# EAGLE design gnss (EAGLE 9.6.2)
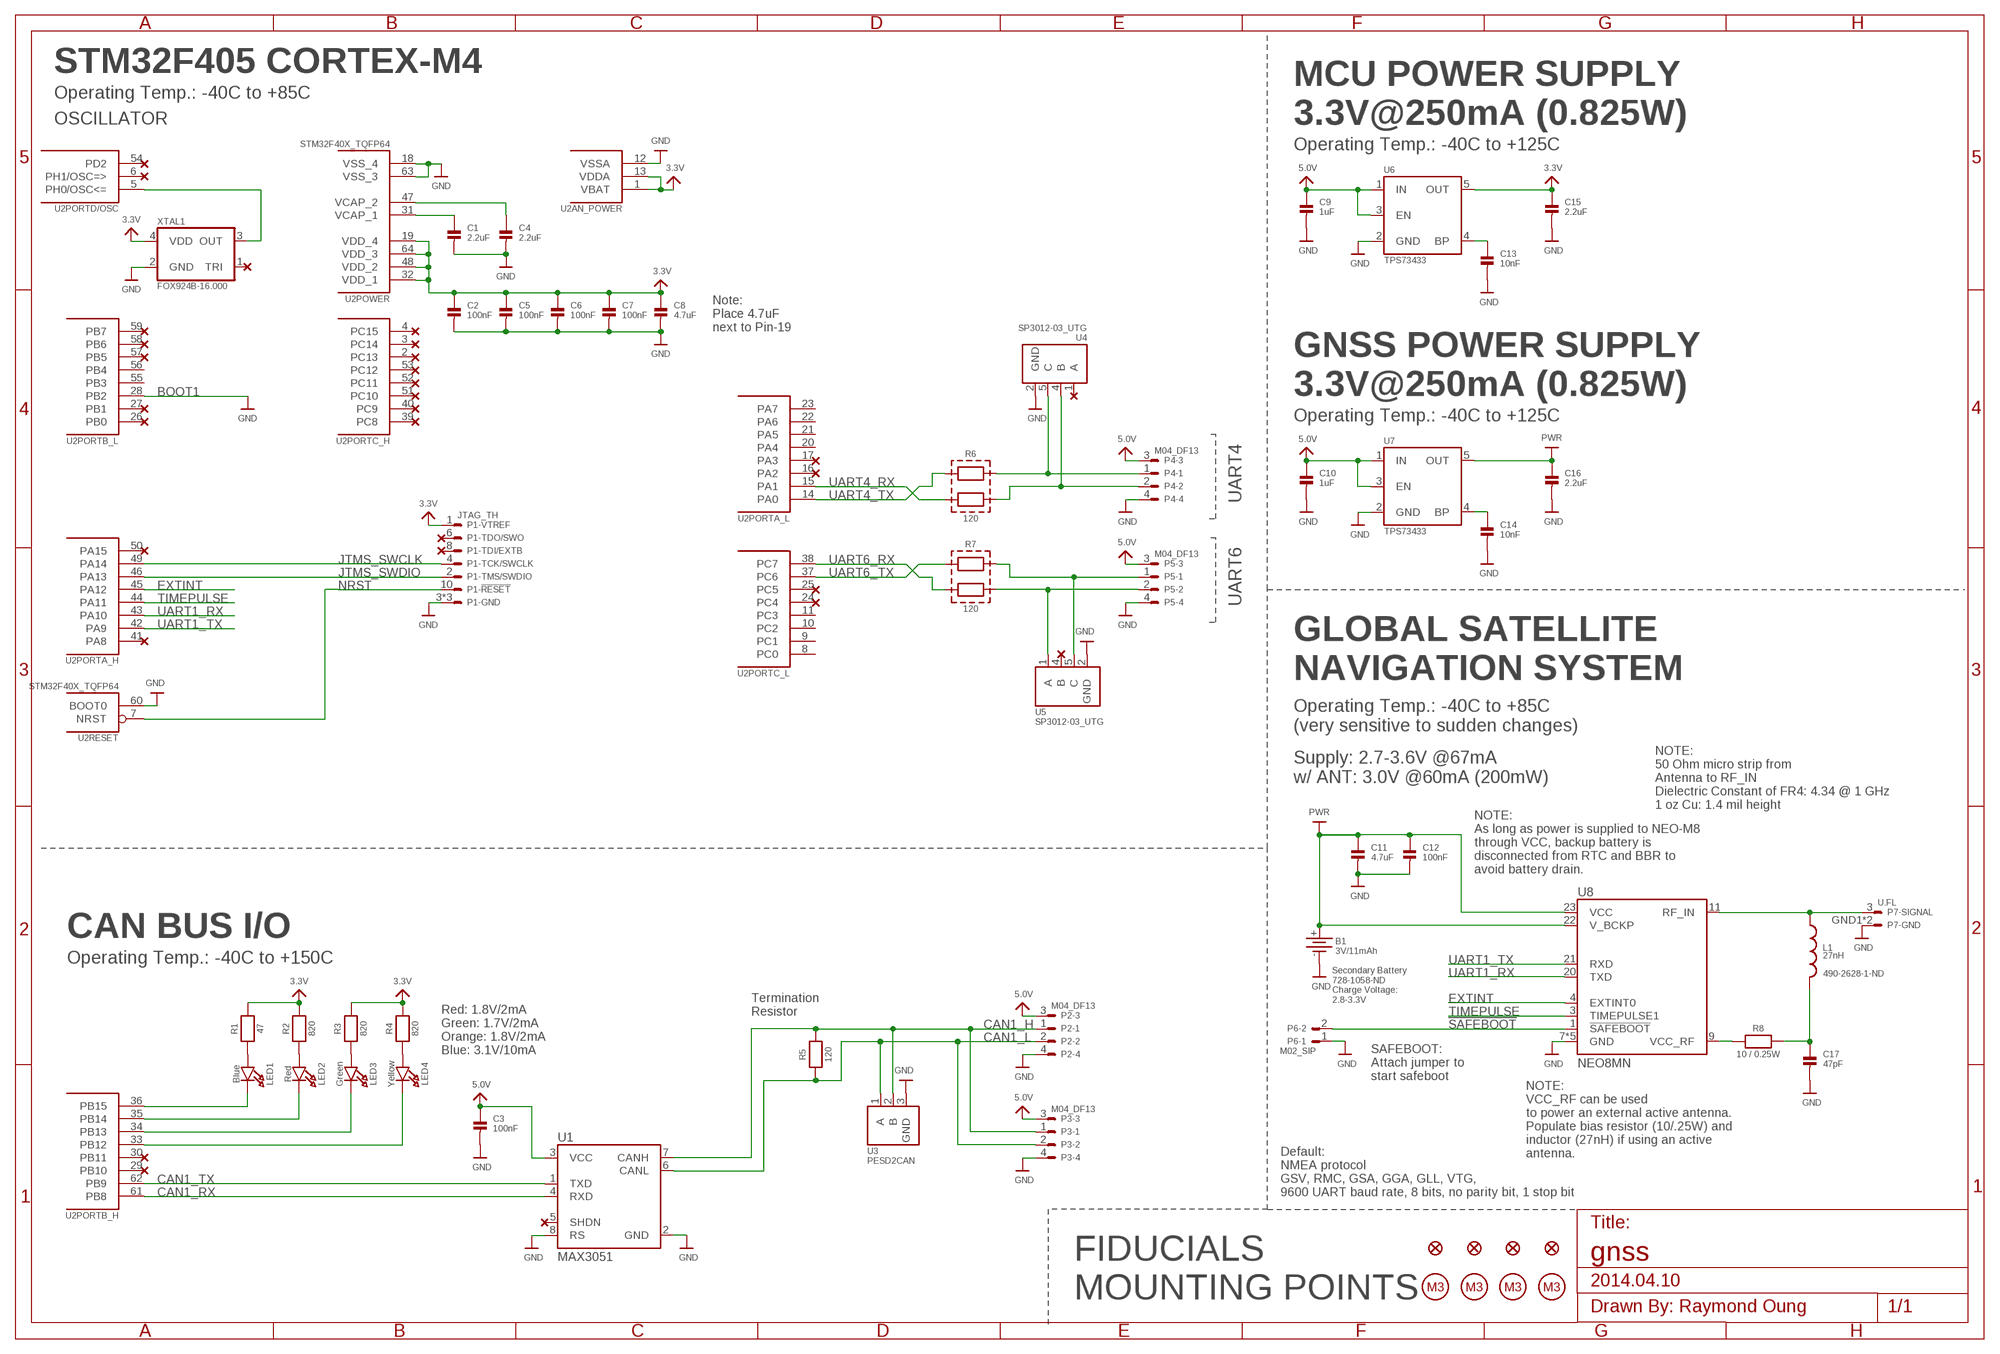
[diagram p0: schematic, sheet 1]

## Parts
B1  3V/11mAh  BATTERY_MS920SE  [MS920SE]
C1  2.2uF  CAP_CERAMIC0402  [0402]
C2  100nF  CAP_CERAMIC0402  [0402]
C3  100nF  CAP_CERAMIC0402  [0402]
C4  2.2uF  CAP_CERAMIC0402  [0402]
C5  100nF  CAP_CERAMIC0402  [0402]
C6  100nF  CAP_CERAMIC0402  [0402]
C7  100nF  CAP_CERAMIC0402  [0402]
C8  4.7uF  CAP_CERAMIC0402  [0402]
C9  1uF  CAP_CERAMIC0402  [0402]
C10  1uF  CAP_CERAMIC0402  [0402]
C11  4.7uF  CAP_CERAMIC0402  [0402]
C12  100nF  CAP_CERAMIC0402  [0402]
C13  10nF  CAP_CERAMIC0402  [0402]
C14  10nF  CAP_CERAMIC0402  [0402]
C15  2.2uF  CAP_CERAMIC0402  [0402]
C16  2.2uF  CAP_CERAMIC0402  [0402]
C17  47pF  CAP_CERAMIC0402  [0402]
L1  27nH  INDUCTOR_0402  [L0402]
LED1  Blue  LED_0603  [CHIPLED_0603]
LED2  Red  LED_0603  [CHIPLED_0603]
LED3  Green  LED_0603  [CHIPLED_0603]
LED4  Yellow  LED_0603  [CHIPLED_0603]
MP1  M3  [MP_M3]
MP2  M3  [MP_M3]
MP3  M3  [MP_M3]
MP4  M3  [MP_M3]
P1  JTAG_TH  [FTSH-105-01-XXX-DV]
P2  M04_DF13  [DF13A-4P-1.25H]
P3  M04_DF13  [DF13A-4P-1.25H]
P4  M04_DF13  [DF13A-4P-1.25H]
P5  M04_DF13  [DF13A-4P-1.25H]
P6  M02_SIP  [1X02_LOCK]
P7  U.FL  [U.FL]
R1  47  RESISTOR0402  [0402]
R2  820  RESISTOR0402  [0402]
R3  820  RESISTOR0402  [0402]
R4  820  RESISTOR0402  [0402]
R5  120  RESISTOR0603  [0603]
R6  120  RESISTOR2_0603X2  [EXBV4V]
R7  120  RESISTOR2_0603X2  [EXBV4V]
R8  10 / 0.25W  RESISTOR0603  [0603]
REF1  FIDUCIAL1X2.5  [POINT-1MM]
REF2  FIDUCIAL1X2.5  [POINT-1MM]
REF3  FIDUCIAL1X2.5  [POINT-1MM]
REF4  FIDUCIAL1X2.5  [POINT-1MM]
U1  MAX3051  [SOT23-8]
U2  STM32F40X_TQFP64  [TQFP64]
U3  PESD2CAN  [SOT23-3]
U4  SP3012-03_UTG  [UDFN06]
U5  SP3012-03_UTG  [UDFN06]
U6  TPS73433  [SOT23-5]
U7  TPS73433  [SOT23-5]
U8  NEO8MN  [NEOX]
XTAL1  FOX924B-16.000  TCXO_5.0X3.2A  [OSCILLATOR-5.0X3.2A]

## Nets
3.3V [PWR]: C2.1 C5.1 C6.1 C7.1 C8.1 C15.1 P1.1 R1.2 R2.2 R3.2 R4.2 U2.1(AN_POWER:VBAT) U2.13(AN_POWER:VDDA) U2.19(POWER:VDD_4) U2.32(POWER:VDD_1) U2.48(POWER:VDD_2) U2.64(POWER:VDD_3) U6.5(OUT) XTAL1.4(VDD)
5.0V [PWR]: C3.1 C9.1 C10.1 P2.3 P3.3 P4.3 P5.3 U1.3(VCC) U6.1(IN) U6.3(EN) U7.1(IN) U7.3(EN)
!SAFEBOOT: P6.2 U8.1(!SAFEBOOT)
CAN1_H: P2.1 P3.1 R5.2 U1.7(CANH) U3.2(B)
CAN1_L: P2.2 P3.2 R5.1 U1.6(CANL) U3.1(A)
CAN1_RX: U1.4(RXD) U2.61(PORTB_H:PB8)
CAN1_TX: U1.1(TXD) U2.62(PORTB_H:PB9)
EXTINT: U2.45(PORTA_H:PA12) U8.4(EXTINT0)
GND [PWR]: B1.- C1.2 C2.2 C3.2 C4.2 C5.2 C6.2 C7.2 C8.2 C9.2 C10.2 C11.2 C12.2 C13.2 C14.2 C15.2 C16.2 C17.2 P1.3 P1.5 P1.9 P2.4 P3.4 P4.4 P5.4 P6.1 P7.GND1 P7.GND2 U1.2(GND) U1.8(RS) U2.12(AN_POWER:VSSA) U2.18(POWER:VSS_4) U2.28(PORTB_L:PB2) U2.60(RESET:BOOT0) U2.63(POWER:VSS_3) U3.3(GND) U4.2(GND) U5.2(GND) U6.2(GND) U7.2(GND) U8.7(GND) U8.10(GND) U8.12(GND) U8.13(GND) U8.24(GND) XTAL1.2(GND)
JTMS_SWCLK: P1.4 U2.49(PORTA_H:PA14)
JTMS_SWDIO: P1.2 U2.46(PORTA_H:PA13)
N$1: LED2.A R2.1
N$2: LED3.A R3.1
N$3: LED4.A R4.1
N$4 [RF]: L1.1 P7.3 U8.11(RF_IN)
N$5: LED1.A R1.1
N$6 [PWR]: R8.1 U8.9(VCC_RF)
N$7: LED1.C U2.36(PORTB_H:PB15)
N$8: U2.5(PORTD/OSC:PH0/OSC<=) XTAL1.3(OUT)
N$11: C13.1 U6.4(BP)
N$12: LED2.C U2.35(PORTB_H:PB14)
N$13: LED3.C U2.34(PORTB_H:PB13)
N$14: LED4.C U2.33(PORTB_H:PB12)
N$15: C14.1 U7.4(BP)
N$16 [PWR]: C17.1 L1.2 R8.2
NRST: P1.10 U2.7(RESET:NRST)
P_UART4_RX: P4.2 R6.3 U4.4(B)
P_UART4_TX: P4.1 R6.4 U4.5(C)
P_UART6_RX: P5.2 R7.3 U5.1(A)
P_UART6_TX: P5.1 R7.4 U5.5(C)
PWR [PWR]: B1.+ C11.1 C12.1 C16.1 U7.5(OUT) U8.22(V_BCKP) U8.23(VCC)
TIMEPULSE: U2.44(PORTA_H:PA11) U8.3(TIMEPULSE1)
UART1_RX: U2.43(PORTA_H:PA10) U8.20(TXD)
UART1_TX: U2.42(PORTA_H:PA9) U8.21(RXD)
UART4_RX: R6.2 U2.15(PORTA_L:PA1)
UART4_TX: R6.1 U2.14(PORTA_L:PA0)
UART6_RX: R7.2 U2.38(PORTC_L:PC7)
UART6_TX: R7.1 U2.37(PORTC_L:PC6)
VCAP_1 [PWR]: C1.1 U2.31(POWER:VCAP_1)
VCAP_2 [PWR]: C4.1 U2.47(POWER:VCAP_2)
Unconnected: P1.6 P1.8 U1.5(SHDN) U2.2(PORTC_H:PC13) U2.3(PORTC_H:PC14) U2.4(PORTC_H:PC15) U2.6(PORTD/OSC:PH1/OSC=>) U2.8(PORTC_L:PC0) U2.9(PORTC_L:PC1) U2.10(PORTC_L:PC2) U2.11(PORTC_L:PC3) U2.16(PORTA_L:PA2) U2.17(PORTA_L:PA3) U2.20(PORTA_L:PA4) U2.21(PORTA_L:PA5) U2.22(PORTA_L:PA6) U2.23(PORTA_L:PA7) U2.24(PORTC_L:PC4) U2.25(PORTC_L:PC5) U2.26(PORTB_L:PB0) U2.27(PORTB_L:PB1) U2.29(PORTB_H:PB10) U2.30(PORTB_H:PB11) U2.39(PORTC_H:PC8) U2.40(PORTC_H:PC9) U2.41(PORTA_H:PA8) U2.50(PORTA_H:PA15) U2.51(PORTC_H:PC10) U2.52(PORTC_H:PC11) U2.53(PORTC_H:PC12) U2.54(PORTD/OSC:PD2) U2.55(PORTB_L:PB3) U2.56(PORTB_L:PB4) U2.57(PORTB_L:PB5) U2.58(PORTB_L:PB6) U2.59(PORTB_L:PB7) U4.1(A) U5.4(B) XTAL1.1(TRI)

## Notes on the sheet
- STM32F405 CORTEX-M4
- Operating Temp.: -40C to +85C
- OSCILLATOR
- MCU POWER SUPPLY
  3.3V@250mA (0.825W)
- Operating Temp.: -40C to +125C
- Note: 
  Place 4.7uF 
  next to Pin-19
- BOOT1
- GNSS POWER SUPPLY
  3.3V@250mA (0.825W)
- Operating Temp.: -40C to +125C
- UART4
- UART6
- GLOBAL SATELLITE 
  NAVIGATION SYSTEM
- Operating Temp.: -40C to +85C 
  (very sensitive to sudden changes)
- Supply: 2.7-3.6V @67mA
  w/ ANT: 3.0V @60mA (200mW)
- NOTE:
  50 Ohm micro strip from
  Antenna to RF_IN
  Dielectric Constant of FR4: 4.34 @ 1 GHz
  1 oz Cu: 1.4 mil height
- NOTE:
  As long as power is supplied to NEO-M8
  through VCC, backup battery is
  disconnected from RTC and BBR to 
  avoid battery drain.
- CAN BUS I/O
- Operating Temp.: -40C to +150C
- 490-2628-1-ND
- Secondary Battery
  728-1058-ND
  Charge Voltage:
  2.8-3.3V
- Termination
  Resistor
- Red: 1.8V/2mA
  Green: 1.7V/2mA
  Orange: 1.8V/2mA
  Blue: 3.1V/10mA
- SAFEBOOT:
  Attach jumper to
  start safeboot
- NOTE:
  VCC_RF can be used
  to power an external active antenna.
  Populate bias resistor (10/.25W) and
  inductor (27nH) if using an active
  antenna.
- Default:
  NMEA protocol
  GSV, RMC, GSA, GGA, GLL, VTG,
  9600 UART baud rate, 8 bits, no parity bit, 1 stop bit
- FIDUCIALS
- 2014.04.10
- MOUNTING POINTS

## Library data of the parts
B1 = custom-generic:BATTERY: Coin-Cell Battery
C1-C17 = custom-generic:CAP_CERAMIC: Ceramic Capacitor 0402 - 0402 Surface Mount Capacitors 16pF 50V 5% [Digikey: 445-4899-2-ND] 18pF 50V 5% [Digikey: 490-1281-2-ND] 22pF 50V 5% [Digikey: 490-1283-2-ND] 68pF 50V 5% [Digikey: 490-1289-2-ND] 0.1uF 10V 10% [Digikey: 490-1318-2-ND] 1.0uF 6.3V 10% [Digikey: 490-1320-2-ND] 0603 - 0603 Surface Mount Capacitors 16 pF 50V 5% [Digikey: 445-5051-2-ND] 22 pF 50V [Digikey: PCC220ACVTR-ND] 33 pF 50V 5% [Digikey: 490-1415-1-ND] 56pF 50V 5% [Digikey: 490-1421-1-ND] 220pF 50V 5% [Digikey: 445-1285-1-ND] 680 pF 50V 2200 pF 50V 5% C0G [Digikey: 445-1297-1-ND] 5600 pF 100V 5% X7R [Digikey: 478-3711-1-ND] 0.1 µF 25V 10% [Digikey: PCC2277TR-ND] 0.22 µF 16V 10% X7R [Digikey: 445-1318-1-ND] 1.0 µF 25V 10% [Digikey: 445-5146-2-ND] 0603 - RF Specific 3pF 250V +/-0.1pF RF [Digikey: 712-1347-1-ND] 18 pF 250V 5% [Digikey: 478-3505-1-ND or 712-1322-1-ND] 56 pF 250V 5% C0G RF [Digikey: 490-4867-1-ND] 68 pF 250V RF [Digikey: 490-4868-1-ND] 0805 - 0805 Surface Mount Capacitors 220 pF 250V 2% RF Ceramic Capacitor [Digikey: 712-1398-1-ND] 1000 pF 50V 2% NP0 Ceramic Capacitor [Digikey: 478-3760-1-ND] 0.1 µF 25V 10% Ceramic Capacitor [Digikey: PCC1828TR-ND] 1.0 µF 16V 10% Ceramic Capacitor[Digikey: 490-1691-2-ND] 10.0 µF 10V 10% Ceramic Capacitor[Digikey: 709-1228-1-ND] 10.0 uF 16V 10% Ceramic Capacitor [Digikey: 478-5165-2-ND] 47 uF 6.3V 20% Ceramic Capacitor [Digikey: 587-1779-1-ND or 399-5506-1-ND] 1206 - 1206 Surface Mount Capacitors 47uF 10V 20% Ceramic Capacitor [Digikey: 490-5528-1-ND or 399-5508-1-ND or 445-6010-1-ND]
L1 = custom-generic:INDUCTOR: Inductors Basic Inductor/Choke - 0603 and 1206. Footprints are not proven and vary greatly between part numbers.
LED1-LED4 = custom-generic:LED: LED 0603 - 0603 Surface Mount Package 2mA: Blue LED - Low Power (39.2mcd, 10 mA, 3.1Vf) - DigiKey: 475-1383-1-ND Green LED - Low Power (3.9mcd, 2mA, 1.7Vf) - Digikey: 475-2709-1-ND Orange LED - Low Power (9.8mcd, 2mA, 1.8Vf) - Digikey: 475-1194-2-ND Red LED - Low Power (5mcd, 2mA, 1.8Vf) - Digikey: 475-2506-1-ND Yellow LED - Low Power (7mcd, 2mA, 1.8Vf) - Digikey: 475-1196-1-ND 5mA: Blue LED - Low Power (17mcd, 5ma, 2.9Vf) - Digikey: LNJ937W8CRACT-ND 0805 - 0805 Surface Mount Package 2mA: Red LED (8.8mcd, 2mA, 1.8Vf, Clear) - Low Power [Digikey: 475-2510-1-ND] Green LED (5mcd, 2mA, 1.8Vf, Clear) - Low Power [Digikey: 475-2730-1-ND] Yellow LED (11.3mcd, 2mA, 1.8Vf, Clear) - Low Power [Digikey: 475-2555-1-ND] 20mA: Red LED (104mcd, 20mA, Diffused) - LS R976 [Digikey: 475-1278-6-ND] Red LED (12mcd, 20mA, 2.0Vf, Clear) - APT2012EC [Digikey: 754-1128-1-ND] Green LED (15mcd, 20mA, 2.2Vf, Clear) - APT2012GC [Digikey: 754-1131-1-ND] Orange LED (160mcd, 20mA, 2.1Vf, Clear) - APT2012SECK [Digikey: 754-1130-1-ND] 1206 - 1206 Surface Mount Package Green LED (26mcd, 20mA, Diffused) - LG N971 [Digikey: 475-1407-6-ND] Red LED (15mcd, 20mA, Diffused) - LH N974 [Digikey: 475-1416-6-ND]
MP1-MP4 = custom-mechanical:M3: Mounting Point M3
P1 = custom-connectors:JTAG: JTAG Connector; DIGI-KEY: 952-1383-ND; MOUSER: 855-M50-3500542
P2-P5 = custom-connectors:M04: 4-Way Connector; DIGI-KEY: H3369-ND; MOUSER: 798-DF13A4P125H20
P6 = custom-connectors:M02: 2-Way Connector
P7 = custom-connectors:U.FL: U.FL Antenna Connector; DIGI-KEY: 931-1107-1-ND; MOUSER: 798-UFLRSMT140
R1-R5 R8 = custom-generic:RESISTOR: Resistors 0402 - 0402 Surface Mount Package 22 Ohm 1% 1/16W [Digikey: 311-22.0LRTR-ND] 33 Ohm 5% 1/16W 1.0K 5% 1/16W 1.5K 5% 1/16W 2.0K 1% 1/16W 10.0K 1% 1/16W [Digikey: 311-10.0KLRTR-ND] 10.0K 5% 1/16W [Digikey: RMCF0402JT10K0TR-ND] 12.1K 1% 1/16W [Digikey: 311-22.0LRTR-ND] 100.0K 5% 1/16W 0603 - 0603 Surface Mount Package 0 Ohm 1/10 Watt 1% Resistor 15 Ohm 1/10 Watt 1% Resistor 33 Ohm 1/10 Watt 1% Resistor 49.9 Ohm 1/10 Watt 1% Resistor 100 Ohm 1/10 Watt 1% Resistor 150 Ohm 1/10 Watt 1% Resistor 240 Ohm 1/10 Watt 1% Resistor 390 Ohm 1/10 Watt 1% Resistor 560 Ohm 1/10 Watt 1% Resistor 680 Ohm 1/10 Watt 1% Resistor 750 Ohm 1/10 Watt 1% Resistor 1.0K Ohm 1/10 Watt 1% Resistor 1.5K Ohm 1/10 Watt 1% Resistor 2.0K Ohm 1/10 Watt 1% Resistor 2.2K Ohm 1/10 Watt 1% Resistor 3.3K Ohm 1/10 Watt 1% Resistor 4.7K Ohm 1/10 Watt 1% Resistor 10.0K Ohm 1/10 Watt 1% Resistor 12.0K Ohm 1/10 Watt 1% Resistor 12.1K Ohm 1/10 Watt 1% Resistor 20.0K Ohm 1/10 Watt 1% Resistor 33.0K Ohm 1/10 Watt 1% Resistor 100.0K Ohm 1/10 Watt 1% Resistor 0805 - 0805 Surface Mount Package 0 Ohm 1/8 Watt 1% Resistor 33 Ohm 1/8 Watt 1% Resistor 100 Ohm 1/8 Watt 1% Resistor 150 Ohm 1/8 Watt 1% Resistor 200 Ohm 1/8 Watt 1% Resistor 240 Ohm 1/8 Watt 1% Resistor 330 Ohm 1/8 Watt 1% Resistor 390 Ohm 1/8 Watt 1% Resistor 470 Ohm 1/8 Watt 1% Resistor 1.0K Ohm 1/8 Watt 1% Resistor 1.5K Ohm 1/8 Watt 1% Resistor 2.0K Ohm 1/8 Watt 1% Resistor 4.7K Ohm 1/8 Watt 1% Resistor 5.1K Ohm 1/8 Watt 1% Resistor 5.6K Ohm 1/8 Watt 1% Resistor 10.0K Ohm 1/8 Watt 1% Resistor 22.0K Ohm 1/8 Watt 1% Resistor 33.0K Ohm 1/8 Watt 1% Resistor 100K Ohm 1/8 Watt 1% Resistor 1206 - 1206 Surface Mount Package 2012 - 2010 Surface Mount Package 0.11 Ohm 1/2 Watt 1% Resistor - Digikey: RHM.11UCT-ND
R6 R7 = custom-generic:RESISTOR2: 2x Isolated Resistor Network
REF1-REF4 = custom-mechanical:FIDUCIAL: Fiducial Alignment Points Various fiducial points for machine vision alignment.
U1 = custom-devices:MAX3051: CAN Transceiver; DIGI-KEY: MAX3051EKA+TCT-ND; MOUSER: 700-MAX3051EKAT
U2 = custom-devices:STM32F40X_TQFP64: STM32F40x 64-pin LQFP; DIGI-KEY: 497-11767-ND; MOUSER: 511-STM32F405RGT6
U3 = custom-devices:PESD2CAN: PESD2CAN in a small SOT23 Surface-Mounted Device (SMD) plastic package designed to protect two automotive Controller Area Network (CAN) bus lines from the damage caused by ElectroStatic Discharge (ESD) and other transients.; DIGI-KEY: 568-4147-1-ND; MOUSER: 771-PESD2CAN-T/R
U4 U5 = custom-devices:SP3012-03: TVS Diode Arrays 3-Ch 12KV 0.5pF; DIGI-KEY: F6292CT-ND; MOUSER: 576-SP3012-03UTG
U6 U7 = custom-devices:TPS73433: 3.3V, 250mA, Low Quiescent Current, Ultra-Low Noise, High PSRR Low-Dropout Linear Regulator.; DIGI-KEY: 296-36844-1-ND; MOUSER: 595-TPS73433TDDCRQ1
U8 = custom-devices:NEO8MN: uBlox GNSS NEO-8MN Module (https://www.u-blox.com/en/product/neo-m8-series)
XTAL1 = custom-generic:TCXO: Temperature Compensated Crystal Oscillator

## Net classes
0 default: width 0.152 mm, drill 0.305 mm, clearance 0.152 mm
1 PWR: width 0.203 mm, drill 0.305 mm, clearance 0.152 mm
2 RF: width 0.8 mm, drill 0.203 mm, clearance 0.125 mm

## Board
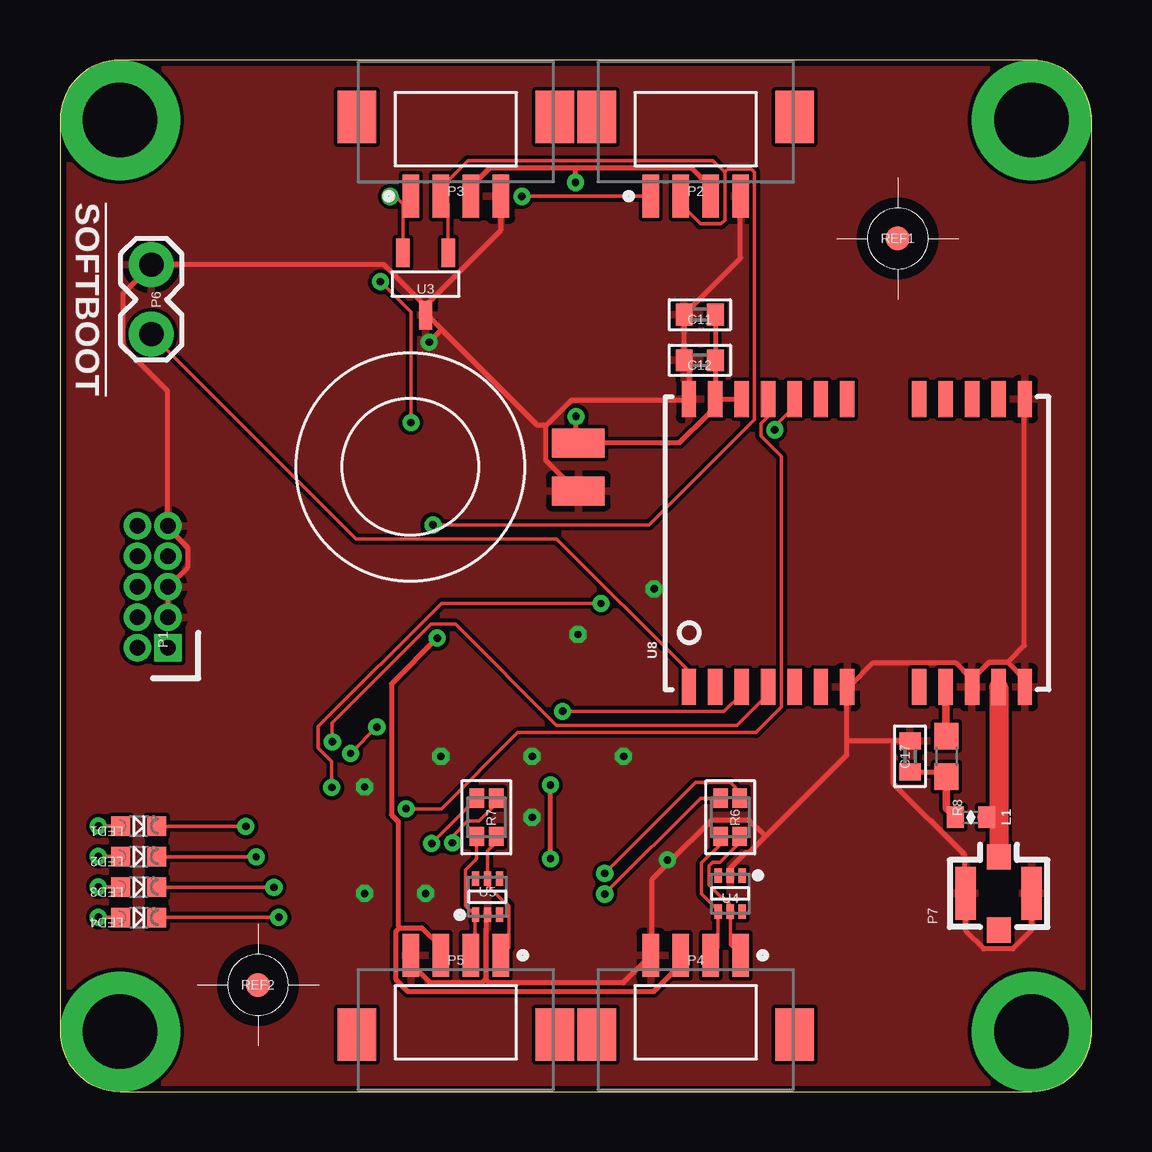
[diagram p1: board, top side]
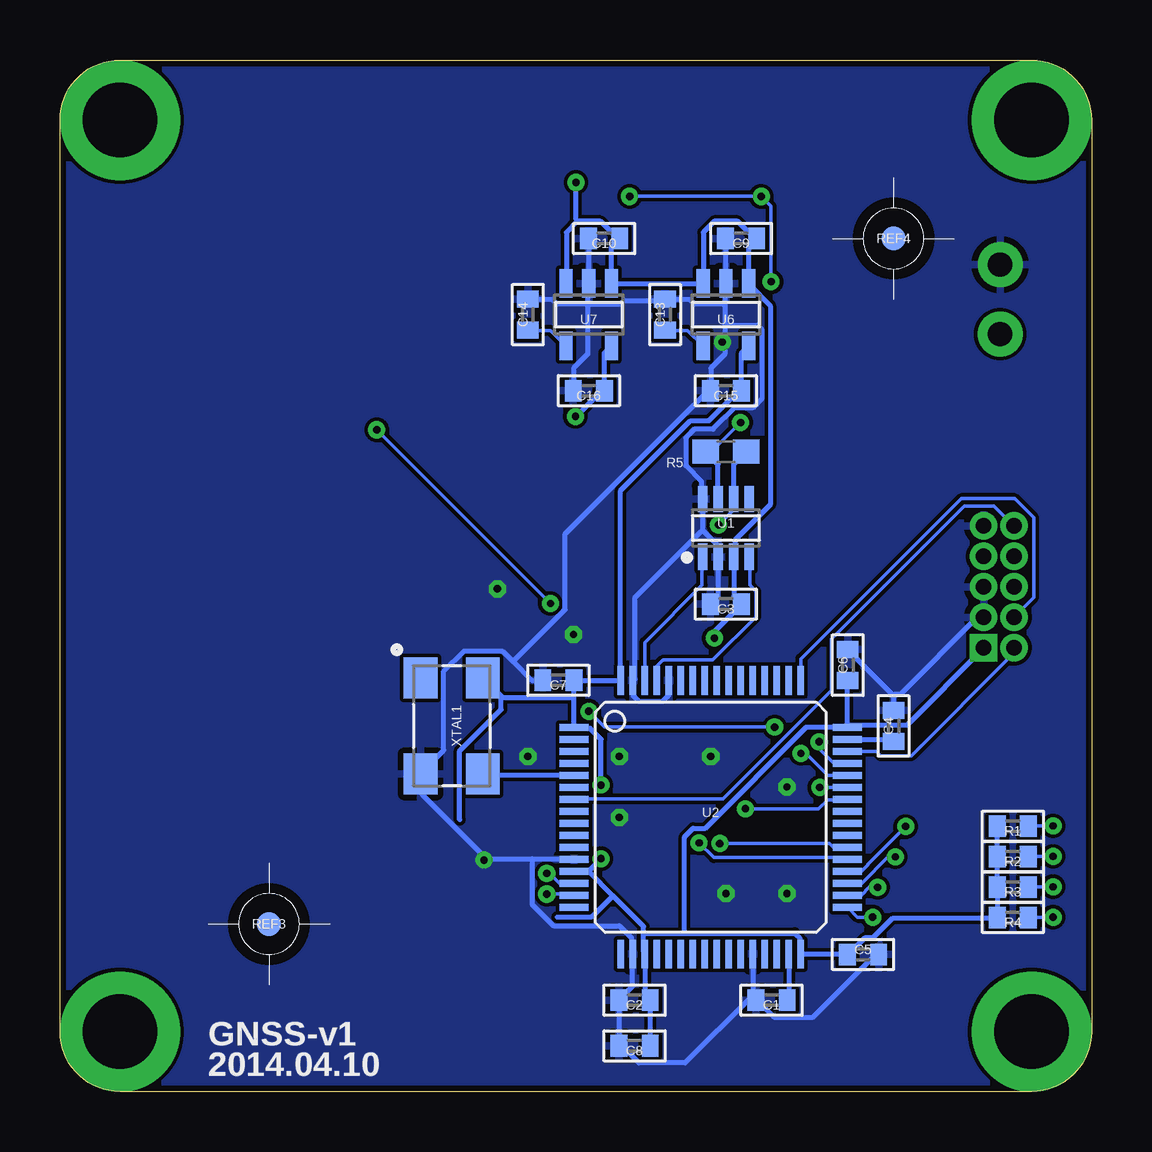
[diagram p2: board, bottom side, seen from below]

Size 43 x 43 mm. Coordinates in mm from the lower left corner, seen from the top.
Outline: 2.5,0 40.5,0 arc90 43,2.5 43,40.5 arc90 40.5,43 2.5,43 arc90 0,40.5 0,2.5 arc90 2.5,0
Copper layers (1*16): Top 0.035mm / dielectric 1.5mm / Bottom 0.035mm
Design rules "BetaLayout-2layer": minimum track width 6mil, minimum drill 8mil, track to track 6mil, track to pad 6mil, pad to pad 6mil, via to via 6mil, smd to smd 0mil, copper to edge 10mil, drill to drill 10mil, minimum pad ring 10mil, minimum via ring 8mil, stop-mask expansion 2mil, vias tented up to drill 100mil, thermal gap 10mil

### Footprints (pad centres in the part's own frame; a part is rotated, then mirrored left to right if it is on the bottom)
MS920SE = smd 2.2 x 1.2: + 7,1; - 7,-1
0402 = smd 0.7 x 0.9: 1 -0.65,0; 2 0.65,0
L0402 = smd 0.7 x 0.9: 1 -0.65,0; 2 0.65,0
CHIPLED_0603 = smd 0.8 x 0.8: A 0,-0.75; C 0,0.75
MP_M3 = drill 3.1 pad 5: NC 0,0
FTSH-105-01-XXX-DV = drill 0.65 pad 1 square: 1 0,0 | drill 0.65 pad 1: 2 0,1.27; 3 1.27,0; 4 1.27,1.27; 5 2.54,0; 6 2.54,1.27; 7 3.81,0; 8 3.81,1.27; 9 5.08,0; 10 5.08,1.27
DF13A-4P-1.25H = smd 0.7 x 1.8: 1 -1.875,0; 2 -0.625,0; 3 0.625,0; 4 1.875,0 | smd 1.6 x 2.2: NC1 -4.125,3.3; NC2 4.125,3.3
1X02_LOCK = drill 1.016 pad 1.88: 1 -0.178,0; 2 2.718,0
U.FL = smd 1.05 x 1: 3 1.525,0; 4 -1.525,0 | smd 2.2 x 0.85: GND1 0,1.375; GND2 0,-1.375
0603 = smd 1.1 x 1: 1 -0.85,0; 2 0.85,0
EXBV4V = smd 0.8 x 0.6: 1 -0.8,0.4; 2 -0.8,-0.4; 3 0.8,-0.4; 4 0.8,0.4
POINT-1MM = smd 1 x 1: 1 0,0
SOT23-8 = smd 0.4 x 1.1: 1 -0.975,-1.204; 2 -0.325,-1.204; 3 0.325,-1.204; 4 0.975,-1.204; 5 0.975,1.204; 6 0.325,1.204; 7 -0.325,1.204; 8 -0.975,1.204
TQFP64 = smd 1.2 x 0.29: 1 -5.7,3.75; 2 -5.7,3.25; 3 -5.7,2.75; 4 -5.7,2.25; 5 -5.7,1.75; 6 -5.7,1.25; 7 -5.7,0.75; 8 -5.7,0.25; 9 -5.7,-0.25; 10 -5.7,-0.75; 11 -5.7,-1.25; 12 -5.7,-1.75; 13 -5.7,-2.25; 14 -5.7,-2.75; 15 -5.7,-3.25; 16 -5.7,-3.75; 33 5.7,-3.75; 34 5.7,-3.25; 35 5.7,-2.75; 36 5.7,-2.25; 37 5.7,-1.75; 38 5.7,-1.25; 39 5.7,-0.75; 40 5.7,-0.25; 41 5.7,0.25; 42 5.7,0.75; 43 5.7,1.25; 44 5.7,1.75; 45 5.7,2.25; 46 5.7,2.75; 47 5.7,3.25; 48 5.7,3.75 | smd 0.29 x 1.2: 17 -3.75,-5.7; 18 -3.25,-5.7; 19 -2.75,-5.7; 20 -2.25,-5.7; 21 -1.75,-5.7; 22 -1.25,-5.7; 23 -0.75,-5.7; 24 -0.25,-5.7; 25 0.25,-5.7; 26 0.75,-5.7; 27 1.25,-5.7; 28 1.75,-5.7; 29 2.25,-5.7; 30 2.75,-5.7; 31 3.25,-5.7; 32 3.75,-5.7; 49 3.75,5.7; 50 3.25,5.7; 51 2.75,5.7; 52 2.25,5.7; 53 1.75,5.7; 54 1.25,5.7; 55 0.75,5.7; 56 0.25,5.7; 57 -0.25,5.7; 58 -0.75,5.7; 59 -1.25,5.7; 60 -1.75,5.7; 61 -2.25,5.7; 62 -2.75,5.7; 63 -3.25,5.7; 64 -3.75,5.7
SOT23-3 = smd 0.55 x 1.2: 1 -0.95,-1.3; 2 0.95,-1.3; 3 0,1.3
UDFN06 = smd 0.3 x 0.6: 1 -0.5,-0.75; 2 0,-0.75; 3 0.5,-0.75; 4 0.5,0.75; 5 0,0.75; 6 -0.5,0.75
SOT23-5 = smd 0.55 x 1.2: 1 -0.95,-1.3; 2 0,-1.3; 3 0.95,-1.3; 4 0.95,1.3; 5 -0.95,1.3
NEOX = smd 1.5 x 0.6: 1 -6,6.8; 2 -6,5.7; 3 -6,4.6; 4 -6,3.5; 5 -6,2.4; 6 -6,1.3; 7 -6,0.2; 8 -6,-2.8; 9 -6,-3.9; 10 -6,-5; 11 -6,-6.1; 12 -6,-7.2; 13 6,-7.2; 14 6,-6.1; 15 6,-5; 16 6,-3.9; 17 6,-2.8; 18 6,0.2; 19 6,1.3; 20 6,2.4; 21 6,3.5; 22 6,4.6; 23 6,5.7; 24 6,6.8
OSCILLATOR-5.0X3.2A = smd 1.7 x 1.4: 1 -2,-1.3; 2 2,-1.3; 3 2,1.3; 4 -2,1.3

### Placement (x,y rotation side)
B1  14.61,26.04 0 top
C1  13.34,3.81 180 bottom
C2  19.05,3.81 180 bottom
C3  15.24,20.32 180 bottom
C4  8.26,15.24 90 bottom
C5  9.53,5.71 0 bottom
C6  10.16,17.78 90 bottom
C7  22.23,17.14 180 bottom
C8  19.05,1.91 180 bottom
C9  14.61,35.56 180 bottom
C10  20.32,35.56 180 bottom
C11  26.67,32.38 180 top
C12  26.67,30.48 180 top
C13  17.78,32.38 90 bottom
C14  23.5,32.38 90 bottom
C15  15.24,29.21 180 bottom
C16  20.95,29.21 180 bottom
C17  35.43,13.97 90 top
L1  37.97,11.43 180 top
LED1  3.28,11.06 270 top
LED2  3.28,9.79 270 top
LED3  3.28,8.52 270 top
LED4  3.28,7.25 270 top
MP1  2.5,2.5 0 top
MP2  40.5,2.5 0 top
MP3  2.5,40.5 0 top
MP4  40.5,40.5 0 top
P1  4.5,18.5 90 top
P2  26.5,37.32 0 top
P3  16.5,37.32 0 top
P4  26.5,5.68 180 top
P5  16.5,5.68 180 top
P6  3.81,34.29 270 top
P7  39.12,8.26 90 top
R1  3.28,11.06 180 bottom
R2  3.28,9.79 180 bottom
R3  3.28,8.52 180 bottom
R4  3.28,7.25 180 bottom
R5  15.24,26.67 180 bottom
R6  27.94,11.43 270 top
R7  17.78,11.43 270 top
R8  36.96,13.97 270 top
REF1  34.92,35.56 0 top
REF2  8.26,4.45 0 top
REF3  34.29,6.99 0 bottom
REF4  8.26,35.56 0 bottom
U1  15.24,23.5 0 bottom
U2  15.88,11.43 0 bottom
U3  15.24,33.66 180 top
U4  27.94,8.26 180 top
U5  17.82,8.12 0 top
U6  15.24,32.38 180 bottom
U7  20.95,32.38 180 bottom
U8  33.02,22.86 90 top
XTAL1  26.67,15.24 270 bottom

### Tracks (layer width: path | path; a pad name or v marks a point on that pad's centre or on a via)
3.3V  (via drill 0.3)
  Top 0.203: v20.45,9.7 v20.45,12.78
  Bottom 0.203: 21.57,16.43 U2.1 21.49,15.14 20.9,15.14 20.45,14.68 v20.45,12.78 | 21.57,16.43 C7.1 21.49,17.14 19.63,17.14 U2.64 19.63,17.25 19.63,25.04 16.71,27.96 15.95,27.96 14.76,29.16 14.68,29.16 C15.1 14.59,30.79 U6.5 | C8.1 C2.1 18.62,4.04 U2.19 18.67,5.82 18.67,6.6 | U2.48 10.18,17.11 C6.1 | 24.56,16.43 21.67,16.43 21.57,16.43 | 24.56,16.43 25.35,17.22 XTAL1.4 | U2.48 10.08,15.27 7.7,15.27 4.52,18.44 4.52,18.49 P1.1 | 20.95,9.17 U2.13 | 19.95,8.17 18.67,6.88 18.67,6.6 | 19.95,8.17 20.95,9.17 | 16.97,6.6 18.59,6.6 18.67,6.6 | 16.97,6.6 12.37,6.6 12.17,6.4 12.17,5.82 U2.32 12.11,5.71 C5.1 10.08,5.77 9.42,6.43 9.09,6.43 8.28,7.24 4.04,7.24 R4.2 3.94,7.26 R3.2 3.94,8.61 R2.2 3.94,9.88 3.94,11.05 R1.2 | U2.48 10.26,15.19 11.89,15.19 16.1,10.97 16.61,10.97 16.97,10.62 16.97,6.68 16.97,6.6 | 26.34,11.33 26.34,14.2 24.61,15.93 24.61,16.36 24.56,16.43 | 22.28,7.26 20.85,7.26 20.02,8.1 19.95,8.17 | v20.45,9.7 20.9,9.25 20.95,9.17
5.0V  (via drill 0.3)
  Top 0.203: 14.15,6.83 15.09,6.83 15.88,6.04 P5.3 | 14.15,6.83 14.02,6.71 14.02,4.65 14.5,4.17 24.74,4.17 25.86,5.28 25.86,5.66 P4.3 | 21.49,38.48 26.34,38.48 27.1,37.72 27.1,37.34 P2.3 | 21.49,38.48 17.91,38.48 17.14,37.72 17.14,37.34 P3.3 | v21.49,37.9 21.49,38.41 21.49,38.48 | v15.72,18.9 13.82,16.99 13.82,11.53 14.1,11.25 14.1,6.91 14.15,6.83
  Bottom 0.203: 21.44,36.27 21.89,35.81 21.89,33.71 U7.3 | 21.44,36.27 20.47,36.27 19.79,35.59 C10.1 20,35.23 U7.1 19.91,33.68 16.2,33.68 U6.3 16.18,33.78 16.18,35.81 15.72,36.27 14.76,36.27 14.07,35.59 C9.1 14.29,35.23 U6.1 14.25,33.6 13.39,32.74 13.39,24.46 14.86,22.99 14.86,22.38 U1.3 14.91,20.64 C3.1 14.66,20.24 15.72,19.18 v15.72,18.9 | v21.49,37.9 21.49,36.35 21.44,36.27
!SAFEBOOT
  Top 0.152: P6.2 12.34,23.04 20.7,23.04 26.21,17.53 U8.1
CAN1_H  (via drill 0.3)
  Top 0.152: 14.3,37.01 14.3,34.98 U3.2 | 14.3,37.01 14.61,37.31 P3.1 | v19.25,37.31 P2.1 | v13.77,37.31 13.99,37.31 14.25,37.06 14.3,37.01 | v14.63,27.89 14.63,32.49 v13.36,33.76
  Bottom 0.152: v19.25,37.31 v13.77,37.31 13.72,37.26 13.36,36.91 v13.36,33.76 | v14.63,27.89 15.9,26.62 R5.2
  Bottom 0.203: U1.7 15.56,26.14 R5.2
CAN1_L  (via drill 0.3)
  Top 0.152: U3.1 16.18,34.98 16.18,37.01 P3.2 15.9,37.39 15.9,37.69 17.02,38.81 27.23,38.81 27.71,38.33 | 27.71,38.33 27.71,36.32 27.56,36.17 26.7,36.17 25.88,36.98 P2.2 | v15.54,23.62 24.56,23.62 28.96,28.02 28.96,38.33 28.83,38.46 27.84,38.46 27.76,38.38 27.71,38.33
  Bottom 0.152: v15.54,23.62 14.96,24.21 14.96,24.61 U1.6
  Bottom 0.203: U1.6 14.91,26.14 R5.1
CAN1_RX
  Bottom 0.152: U1.4 14.25,22.28 14.25,21.11 13.99,20.85 13.99,19.79 15.8,17.98 17.86,17.98 18.11,17.73 18.11,17.14 U2.61
CAN1_TX
  Bottom 0.152: U1.1 16.23,22.28 16.23,21.11 18.62,18.72 18.62,17.14 U2.62
EXTINT  (via drill 0.3)
  Top 0.152: v11.35,14.58 11.35,15.37 15.47,19.48 16.48,19.48 20.7,15.27 28.22,15.27 29.52,16.56 29.52,16.84 U8.4
  Bottom 0.152: v11.35,14.58 11.35,14.28 10.77,13.69 10.19,13.69 U2.45
GND  (via drill 0.3)
  Top 0.203: P2.4 28.37,34.75 26.09,32.46 C11.2 C12.2 26.22,30.28 U8.24 26.14,28.8 21.31,28.8 20.24,27.74 | 20.24,27.74 20.24,26.31 21.51,25.04 21.59,25.04 B1.- | P1.3 4.5,19.79 P1.5 4.57,21.11 5.33,21.87 5.33,22.66 4.52,23.47 4.52,23.57 P1.9 4.47,23.67 4.47,29.21 2.62,31.06 2.62,33.25 3.76,34.39 P6.1 13.51,34.47 15.16,32.82 U3.3 | U3.3 15.24,32.77 18.36,35.89 18.36,37.31 P3.4 | 15.91,31.76 15.34,32.33 U3.3 | 15.91,31.76 19.89,27.79 20.17,27.79 20.24,27.74 | v15.39,31.24 15.85,31.7 15.91,31.76 | 39.52,17.88 38.71,17.88 38.02,17.2 U8.10 37.95,17.25 37.31,17.88 33.91,17.88 32.92,16.89 U8.7 32.79,16.76 32.79,14.63 | 39.52,17.88 40.21,17.2 40.21,16.87 U8.12 | U8.13 40.21,28.85 40.21,18.59 39.57,17.96 39.52,17.88 | 17.74,4.66 17.75,4.67 17.75,7.32 | 17.74,4.66 17.6,4.52 15.42,4.52 14.63,5.31 14.63,5.66 P5.4 | 17.75,7.32 U5.2 17.75,7.32 | 17.74,4.66 17.8,4.6 17.88,4.52 23.47,4.52 24.61,5.66 P4.4 24.66,5.77 24.66,8.81 25.41,9.56 | P7.GND2 40.49,8.26 40.49,6.71 39.73,5.94 38.51,5.94 37.77,6.68 37.77,8.26 P7.GND1 37.69,8.33 37.69,9.88 34.72,12.85 34.72,14.55 34.72,14.63 | 29.4,10.63 32.79,14.02 32.79,14.63 | 29.4,10.63 28.73,9.96 28.57,9.96 27.94,9.32 U4.2 | 34.72,14.63 32.87,14.63 32.79,14.63 | 34.72,14.63 C17.2 | 25.41,9.56 27.15,11.3 28.73,11.3 29.34,10.69 29.4,10.63 | v25.32,9.65 25.35,9.63 25.41,9.56
  Bottom 0.203: U2.28 14.12,3.95 C1.2 | C3.2 15.56,20.64 U1.2 15.62,22.38 15.62,22.81 16.2,23.39 | C9.2 15.26,33.7 U6.2 15.29,33.6 15.29,32.82 | C10.2 20.97,33.7 U7.2 21.01,33.6 21.01,32.82 | 16.2,23.39 U1.8 16.26,24.79 16.26,25.43 16.92,26.09 16.92,27.25 16.56,27.61 15.77,27.61 14.88,28.5 14.12,28.5 13.74,28.88 13.74,31.77 13.92,31.95 15.21,31.95 15.29,31.95 | U2.60 17.63,16.51 17.88,16.26 18.87,16.26 19.1,16.48 19.1,17.12 U2.63 19.02,17.2 19.02,20.6 16.28,23.34 16.2,23.39 | 15.29,32.82 15.29,31.95 | 15.29,31.95 15.29,31.24 | 15.29,31.24 15.29,30.73 15.88,30.15 15.88,29.21 C15.2 15.98,29.16 16.03,29.16 21.95,23.24 21.95,20.09 24.05,17.98 24.12,17.92 | 15.29,32.82 15.37,32.82 16.56,32.82 16.76,33.02 C13.2 17.86,32.97 19.48,32.97 19.63,32.82 20.93,32.82 21.01,32.82 | 21.01,32.82 21.01,30.73 21.59,30.15 C16.2 | C14.2 22.48,33.02 22.28,32.82 21.08,32.82 21.01,32.82 | 8.26,16.51 C4.2 | 8.26,16.51 10.16,18.41 C6.2 | 8.26,16.51 8.18,16.56 7.98,16.56 4.78,19.76 4.52,19.76 P1.3 | v15.39,31.24 15.37,31.24 15.29,31.24 | C5.2 8.99,5.71 11.61,3.1 13.23,3.1 13.89,3.76 C1.2 | C1.2 14.22,3.91 16.94,1.19 18.87,1.19 19.53,1.85 19.61,1.85 C8.2 C2.2 19.63,3.89 19.13,4.39 19.13,5.71 U2.18 19.18,5.82 19.18,6.4 19.68,6.91 22.43,6.91 23.32,7.8 23.32,9.63 23.32,9.7 | 24.12,17.92 24.56,18.36 26.16,18.36 27,17.53 27,14.22 27.96,13.26 XTAL1.2 27.91,13.16 27.91,12.39 25.22,9.7 | 24.12,17.92 23.34,17.14 C7.2 | P1.3 4.5,19.79 4.56,19.83 | 4.45,19.84 P1.3 | 25.22,9.7 23.32,9.7 | 23.32,9.7 21.59,9.7 U2.12 | v25.32,9.65 25.3,9.65 25.22,9.7
  other vias: 12.7,8.26 15.24,8.26 19.68,13.97 15.88,13.97 21.59,19.05 24.77,20.95 23.5,13.97 12.7,12.7 19.68,11.43
  pour Bottom: 2.5,0 40.5,0 arc90 43,2.5 43,40.5 arc90 40.5,43 2.5,43 arc90 0,40.5 0,2.5 arc90
  pour Top: 2.5,0 40.5,0 arc90 43,2.5 43,40.5 arc90 40.5,43 2.5,43 arc90 0,40.5 0,2.5 arc90
JTMS_SWCLK
  Bottom 0.152: U2.49 12.12,17.14 12.12,18.03 5.44,24.71 3.2,24.71 2.41,23.93 2.41,20.6 3.23,19.79 P1.4
JTMS_SWDIO
  Bottom 0.152: U2.46 10.16,14.17 8.97,14.17 8.79,13.99 7.52,13.99 3.25,18.26 3.25,18.49 P1.2
N$1  (via drill 0.3)
  Top 0.152: v1.6,9.8 2.52,9.8 LED2.A
  Bottom 0.152: v1.6,9.8 2.62,9.8 R2.1
N$2  (via drill 0.3)
  Top 0.152: v1.6,8.53 2.52,8.53 LED3.A
  Bottom 0.152: v1.6,8.53 2.62,8.53 R3.1
N$3  (via drill 0.3)
  Top 0.152: v1.6,7.26 2.52,7.26 LED4.A
  Bottom 0.152: v1.6,7.26 2.62,7.26 R4.1
N$4
  Top 0.6: U8.11 | 38.63,11.43 L1.1
  Top 0.8: U8.11 39.12,11.43 | 39.12,11.43 P7.3 | 38.63,11.43 39.12,11.43
N$5  (via drill 0.3)
  Top 0.152: v1.6,11.07 2.52,11.07 LED1.A
  Bottom 0.152: v1.6,11.07 2.62,11.07 R1.1
N$6
  Top 0.305: R8.1 36.92,14.82 U8.9
N$7  (via drill 0.3)
  Top 0.152: v7.75,11.05 4.04,11.05 LED1.C
  Bottom 0.152: v7.75,11.05 9.32,9.47 9.32,9.45 9.58,9.2 10.16,9.2 U2.36
N$8
  Bottom 0.203: U2.5 25.31,13.18 XTAL1.3
N$11
  Bottom 0.152: C13.1 16.84,31.73 16.2,31.09 U6.4
N$12  (via drill 0.3)
  Top 0.152: v8.18,9.78 LED2.C
  Bottom 0.152: v8.18,9.78 8.48,9.78 9.58,8.69 10.16,8.69 U2.35
N$13  (via drill 0.3)
  Top 0.152: v8.91,8.51 LED3.C
  Bottom 0.152: v8.91,8.51 9.27,8.51 9.58,8.2 10.16,8.2 U2.34
N$14  (via drill 0.3)
  Top 0.152: v9.12,7.26 4.04,7.26 LED4.C
  Bottom 0.152: v9.12,7.26 9.75,7.26 10.16,7.67 U2.33
N$15
  Bottom 0.152: C14.1 22.55,31.73 21.92,31.09 U7.4
N$16
  Top 0.203: C17.1 36.73,13.31 36.83,13.21 R8.2
  Top 0.305: R8.2 36.96,11.8 L1.2
NRST
  Bottom 0.152: U2.7 21.57,12.19 15.37,12.19 10.85,16.71 10.85,18.87 5.31,24.41 4.06,24.41 3.25,23.6 P1.10
P_UART4_RX
  Top 0.152: P4.2 27.43,5.99 27.43,7.49 U4.4 27.41,7.57 26.75,8.23 26.75,9.53 27.53,10.31 27.53,10.62 R6.3
P_UART4_TX
  Top 0.152: P4.1 27.94,6.12 27.94,7.49 U4.5 27.91,7.57 27.91,7.82 27.69,8.05 27.61,8.05 27.05,8.61 27.05,9.4 27.2,9.55 27.51,9.55 28.32,10.36 28.32,10.62 R6.4
P_UART6_RX
  Top 0.152: P5.2 17.14,5.69 17.3,5.84 17.3,7.37 U5.1 17.25,7.42 16.92,7.75 16.92,9.25 17.37,9.7 17.37,10.62 R7.3
P_UART6_TX
  Top 0.152: R7.4 18.16,10.62 18.16,10.36 17.83,10.03 17.83,8.89 U5.5 17.86,8.81 17.86,8.56 18.52,7.9 18.57,7.9 18.72,7.75 18.72,6.02 P5.1
PWR  (via drill 0.3)
  Top 0.203: C11.1 C12.1 U8.23 | 27.13,28.27 U8.23 | U8.22 28.4,28.85 27.41,28.85 U8.23 | U8.23 27.05,28.22 27,28.22 25.83,27.05 B1.+ 21.57,27.13 21.51,27.18 v21.51,28.14
  Bottom 0.203: U7.5 20.3,30.79 C16.1 20.4,29.16 20.47,29.16 21.49,28.14 v21.51,28.14
TIMEPULSE  (via drill 0.3)
  Top 0.152: v13.21,15.19 v12.12,14.1 | v20.95,15.85 27.69,15.85 28.4,16.56 28.4,16.84 U8.3
  Bottom 0.152: v12.12,14.1 11.91,14.1 11,13.18 U2.44 | v13.21,15.19 20.3,15.19 v20.95,15.85
UART1_RX  (via drill 0.3)
  Top 0.152: v11.33,12.68 11.33,13.77 10.77,14.33 10.77,15.21 15.9,20.34 v22.55,20.34 | v29.79,27.58 29.79,27.74 30.61,28.55 30.61,28.85 U8.20
  Bottom 0.152: v11.33,12.68 U2.43 | v29.79,27.58 v22.55,20.34
UART1_TX  (via drill 0.3)
  Top 0.152: v14.43,11.79 15.9,11.79 19.07,14.96 29.01,14.96 30.07,16.03 30.07,26.47 29.21,27.33 29.21,27.84 29.52,28.14 U8.21
  Bottom 0.152: v14.43,11.79 11.38,11.79 11,12.17 10.19,12.17 U2.42
UART4_RX  (via drill 0.3)
  Top 0.152: v22.71,8.23 26.7,12.22 27.53,12.22 R6.2
  Bottom 0.152: v22.71,8.23 21.61,8.23 21.59,8.2 U2.15
UART4_TX  (via drill 0.3)
  Top 0.152: v22.71,9.09 26.49,12.88 27.94,12.88 28.32,12.5 28.32,12.24 R6.1
  Bottom 0.152: v22.71,9.09 22.58,9.09 22.17,8.69 21.59,8.69 U2.14
UART6_RX  (via drill 0.3)
  Top 0.152: v15.49,10.34 17.37,12.22 R7.2
  Bottom 0.152: v15.49,10.34 10.92,10.34 10.77,10.19 U2.38
UART6_TX  (via drill 0.3)
  Top 0.152: v16.36,10.36 16.36,10.64 16.99,11.28 17.48,11.28 18.16,11.96 18.16,12.22 R7.1
  Bottom 0.152: v16.36,10.36 15.75,9.75 10.24,9.75 10.19,9.7 U2.37
VCAP_1
  Bottom 0.203: C1.1 12.62,3.87 U2.31
VCAP_2
  Bottom 0.203: U2.47 8.35,14.68 C4.1

### Text on the board
tPlace: !SOFTBOOT
bPlace: GNSS-v1 | 2014.04.10
Reference: Ref. (0,0)
tDocu: Coplanar Waveguide: / Relative Dielectric Constant of FR4: 4.8 / Track Width: 0.8 mm / Gap Width: 0.125 mm / Dielectric Thickness: 1.55 mm / -- / Effective Dielectric Constant: 2.939 / Characteristic Impedance: 50.01 Ohms